# EAGLE schematic Copy of electretMicPreamp - THT (EAGLE 8.7.0)
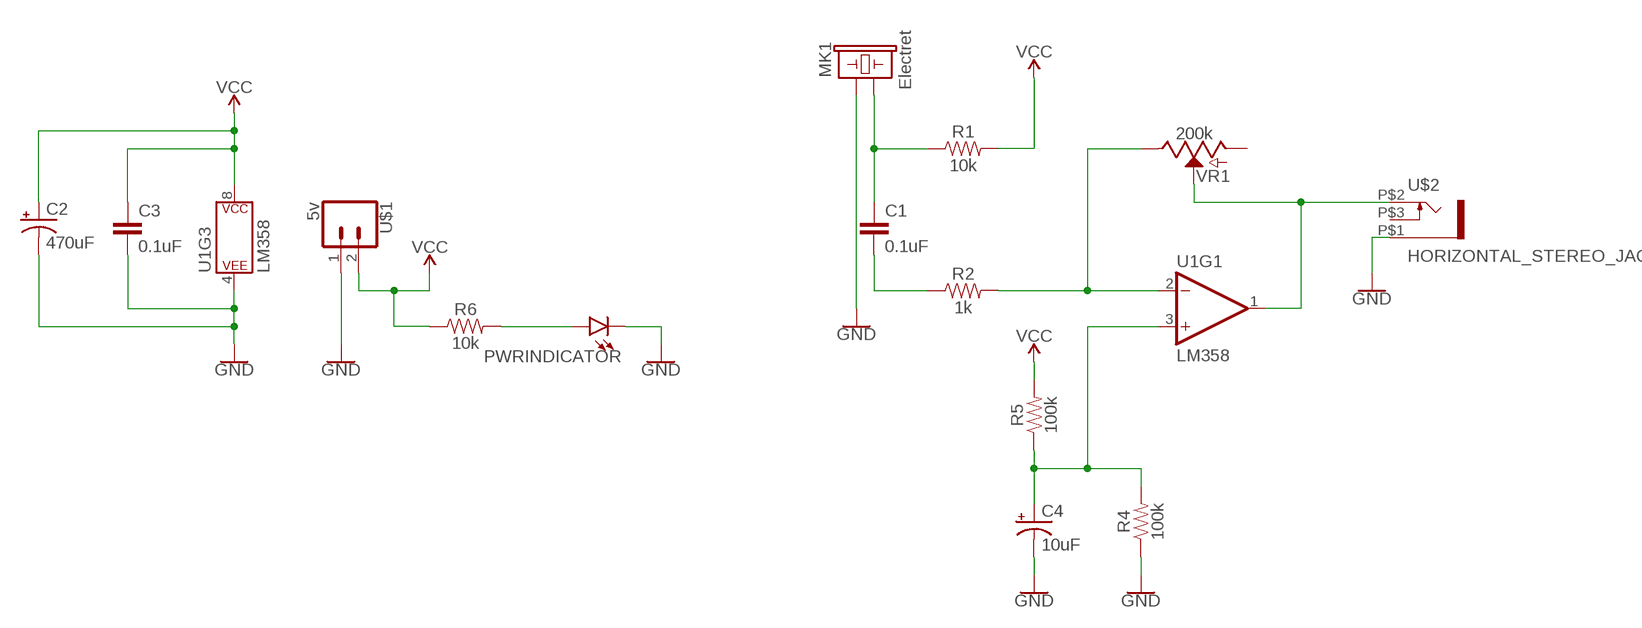
[diagram p0: schematic, sheet 1]

## Parts
C1  0.1uF  0.1UF-KIT-EZ-50V-20%  [CAP-PTH-SMALL-KIT]
C2  470uF  10UF-POLAR-RADIAL-2.5MM-25V-20%  [CPOL-RADIAL-2.5MM-5MM]
C3  0.1uF  0.1UF-KIT-EZ-50V-20%  [CAP-PTH-SMALL-KIT]
C4  10uF  10UF-POLAR-RADIAL-2.5MM-25V-20%  [CPOL-RADIAL-2.5MM-5MM]
MK1  Electret  MIC-PTH  [MICROPHONE-PTH-9.7MM]
PWRINDICATOR  LED-3MM-NO_SILK  [LED_3MM-NS]
R1  10k  1KOHM-HORIZ-1/4W-5%  [AXIAL-0.3]
R2  1k  1KOHM-HORIZ-1/4W-5%  [AXIAL-0.3]
R4  100k  1KOHM-HORIZ-1/4W-5%  [AXIAL-0.3]
R5  100k  1KOHM-HORIZ-1/4W-5%  [AXIAL-0.3]
R6  10k  1KOHM-HORIZ-1/4W-5%  [AXIAL-0.3]
U1  LM358  LM358KIT  [DIP08-KIT]
U$1  5v  SCREWTERMINAL-1X2  [SCREWTERMINAL-2X1]
U$2  HORIZONTAL_STEREO_JACK  HORIZONTAL_STERO_JACK  [HORIZONTAL_STEREO_JACK]
VR1  200k  POTENTIOMETER-PTH-9MM-1/20W-20%  [POT-PTH-ALPS]

## Nets
GND: C2.2(-) C3.2 C4.2(-) MK1.1 PWRINDICATOR.K(C) R4.P$1 U1.4(P$V-) U$1.1 U$2.P$1
N$1: C1.1 MK1.2 R1.P$1
N$2: C1.2 R2.P$1
N$3: R2.P$2 U1.2(-IN) VR1.P$1(E)
N$5: U1.1(OUT) U$2.P$2 VR1.P$2(S)
N$6: PWRINDICATOR.A R6.P$2
N$7: C4.1(+) R4.P$2 R5.P$1 U1.3(+IN)
VCC: C2.1(+) C3.1 R1.P$2 R5.P$2 R6.P$1 U1.8(P$V+) U$1.2
Unconnected: U1.5(+IN) U1.6(-IN) U1.7(OUT) U$2.P$3 VR1.P$3(A)

## Library data of the parts
C1 C3 = SparkFun-Capacitors:0.1UF: 0.1µF ceramic capacitors A capacitor is a passive two-terminal electrical component used to store electrical energy temporarily in an electric field.; PROD_ID: CAP-08370
C2 = SparkFun-Capacitors:10UF-POLAR: 10.0µF polarized capacitors A capacitor is a passive two-terminal electrical component used to store electrical energy temporarily in an electric field.; PROD_ID: CAP-08440; VALUE: 10uF
C4 = SparkFun-Capacitors:10UF-POLAR: 10.0µF polarized capacitors A capacitor is a passive two-terminal electrical component used to store electrical energy temporarily in an electric field.; PROD_ID: CAP-08440
MK1 = SparkFun-Retired:MIC: Microphone Omni-directional electret microphones - one through-hole, the other SMD. Datasheet <http://cdn.sparkfun.com/datasheets/Sensors/Sound/CEM-C9745JAD462P2.54R.pdf> (through-hole mic) Datasheet <http://www.challengeelectronics.com/downloads/microphones/omni_directional/CEM-OB6018-3EAD443C43MR.pdf> (SMD mic) SparkFun Products PTH Electret Microphone <https://www.sparkfun.com/products/8635> (COM-08635) SparkFun Electret Microphone Breakout <https://www.sparkfun.com/products/9964> (BOB-09964) Digital Sandbox <https://www.sparkfun.com/products/12651> (DEV-12651) SparkFun Sound Detector <https://www.sparkfun.com/products/12642> (SEN-12642) SMD Microphone SparkFun Voice Recorder Breakout - ISD1932 <https://www.sparkfun.com/products/retired/10653> (BOB-10653); PROD_ID: COMP-08856; SF_ID: COM-08635
PWRINDICATOR = SparkFun-LED:LED: LED (Generic) Standard schematic elements and footprints for 5mm, 3mm, 1206, and 0603 sized LEDs. Generic LEDs with no color specified.
R1 R4-R6 = SparkFun-Resistors:1KOHM: 1kΩ resistor A resistor is a passive two-terminal electrical component that implements electrical resistance as a circuit element. Resistors act to reduce current flow, and, at the same time, act to lower voltage levels within circuits. - Wikipedia; PROD_ID: RES-08380; VALUE: 1k
R2 = SparkFun-Resistors:1KOHM: 1kΩ resistor A resistor is a passive two-terminal electrical component that implements electrical resistance as a circuit element. Resistors act to reduce current flow, and, at the same time, act to lower voltage levels within circuits. - Wikipedia; PROD_ID: RES-08380
U1 = SparkFun-IC-Amplifiers:LM358: LM358 Jellybean op-amp Datasheet <http://www.sparkfun.com/datasheets/Components/General/LM358.pdf> SparkFun Products Op-Amp (Thru-Hole) - LM358 <https://www.sparkfun.com/products/9456> (COM-09456); PROD_ID: IC-09172
U$1 = SparkFun-Connectors:SCREWTERMINAL-1X2
U$2 = thonkiconn:HORIZONTAL_STERO_JACK
VR1 = SparkFun-Resistors:POTENTIOMETER: Potentiometer (Pot) Three-terminal potentiometers, with an adjustable wiper and two adjustable resistors. A pot can be used to create a configurable voltage divider, or as a variable resistor. Variants ALPS_POT and ALPS_POT_KIT - PTH, breadboard compatible, 9mm square pots Rotary Potentiometer - Linear (10k ohm) <https://www.sparkfun.com/products/9288> (COM-09288) The KIT variant exposes copper on only one side of the PTH pad, so the part can only be assembled on one side of the PCB. Useful for beginner soldering kits.; PROD_ID: RES-09177; SF_SKU: COM-09288; VALUE: 10k